# EAGLE design piezo-preamp-tickler_V3-10_single-supply-OPA1642 (EAGLE 8.5.0)

## Sheet 1 of 2
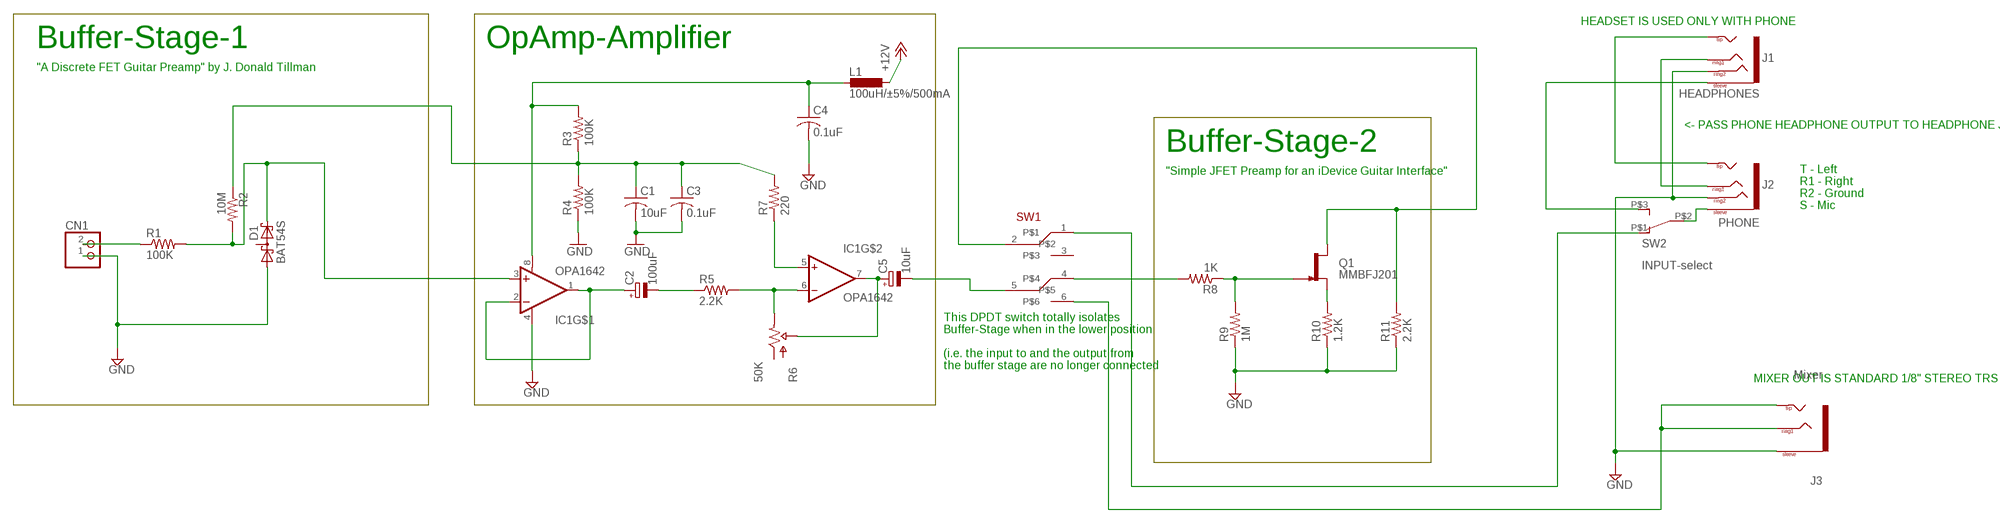
[diagram p0: schematic, sheet 1]

### Parts
C1  10uF  C-USC0805K  [C0805K]
C2  100uF  CPOL-EUC  [PANASONIC_C]
C3  0.1uF  C-USC0805K  [C0805K]
C4  0.1uF  C-USC0805K  [C0805K]
C5  10uF  CPOL-EUB  [PANASONIC_B]
CN1  JST_2PIN-THM  [JST-PH-2-THM]
D1  BAT54S  [SOT23]
IC1  OPA1642  [SO08]
J1  HEADPHONES  TRRS-1/8"-3.5MMLGPADS  [TRRS_SJ-43514-SMT-TR]
J2  PHONE  TRRS-1/8"-3.5MMLGPADS  [TRRS_SJ-43514-SMT-TR]
J3  Mixer  TRS-1/8"-3.5MM  [TRS_SJ-3524-SMT]
L1  100uH/±5%/500mA  L-EUL3225M  [L3225M]
Q1  MMBFJ201  J201SOT-23  [SOT23-3]
R1  100K  R-US_R0603  [R0603]
R2  10M  R-US_R0603  [R0603]
R3  100K  R-US_R0603  [R0603]
R4  100K  R-US_R0603  [R0603]
R5  2.2K  R-US_R0603  [R0603]
R6  50K  POTTHUMBPOT14  [THUMBPOT14MM]
R7  220  R-US_R0603  [R0603]
R8  1K  R-US_R0603  [R0603]
R9  1M  R-US_R0603  [R0603]
R10  1.2K  R-US_R0603  [R0603]
R11  2.2K  R-US_R0603  [R0603]
SW1  SWITCH_DPDT  [SWITCH_DPDT_CL-SB-22B]
SW2  INPUT-select  SWITCH_SPDTCL-SB-12B  [SWITCH_SPDT_CL-SB-12B]

### Nets
+12V: L1.1 ; also sheet 2
GND: C1.2 C3.2 C4.2 CN1.1 D1.1(A1) IC1.4(V-) J1.RING2 J2.RING2 J3.1(SLEEVE) R4.1 R9.1 R10.1 R11.1 ; also sheet 2
N$1: D1.2(C2) IC1.3(+IN) R1.2 R2.2
N$2: CN1.2 R1.1
N$3: Q1.2(S) R10.2
N$4: J1.EARTH(SLEEVE) SW2.P$3
N$5: IC1.5(+IN) R7.1
N$6: C5.+ IC1.7(OUT) R6.P$2(WIPER)
N$7: IC1.6(-IN) R5.2 R6.P$3(OUT)
N$8: C4.1 IC1.8(V+) L1.2 R3.2
N$9: C1.1 C3.1 R2.1 R3.1 R4.2 R7.2
N$10: Q1.3(G) R8.1 R9.2
N$11: R8.2 SW1.4
N$12: J3.2(TIP) J3.3(RING1) J3.4(TIP) SW1.6
N$13: J1.RING1 J2.RING1
N$14: C2.- R5.1
N$16: C5.- SW1.5
N$17: J2.EARTH(SLEEVE) SW2.P$2
N$19: SW1.1 SW2.P$1
N$24: C2.+ IC1.1(OUT) IC1.2(-IN)
N$33: J1.TIP J2.TIP
SELECT: Q1.1(D) R11.2 SW1.2
Unconnected: D1.3(C1A2) R6.P$1(IN) SW1.3

### Notes on the sheet
- HEADSET IS USED ONLY WITH PHONE
- Buffer-Stage-1 | OpAmp-Amplifier
- "A Discrete FET Guitar Preamp" by J. Donald Tillman
- <- PASS PHONE HEADPHONE OUTPUT TO HEADPHONE JACK
- Buffer-Stage-2
- "Simple JFET Preamp for an iDevice Guitar Interface"
- T - Left
  R1 - Right
  R2 - Ground
  S - Mic
- This DPDT switch totally isolates 
  Buffer-Stage when in the lower position
  
  (i.e. the input to and the output from 
  the buffer stage are no longer connected
- MIXER OUT IS STANDARD 1/8" STEREO TRS

## Sheet 2 of 2
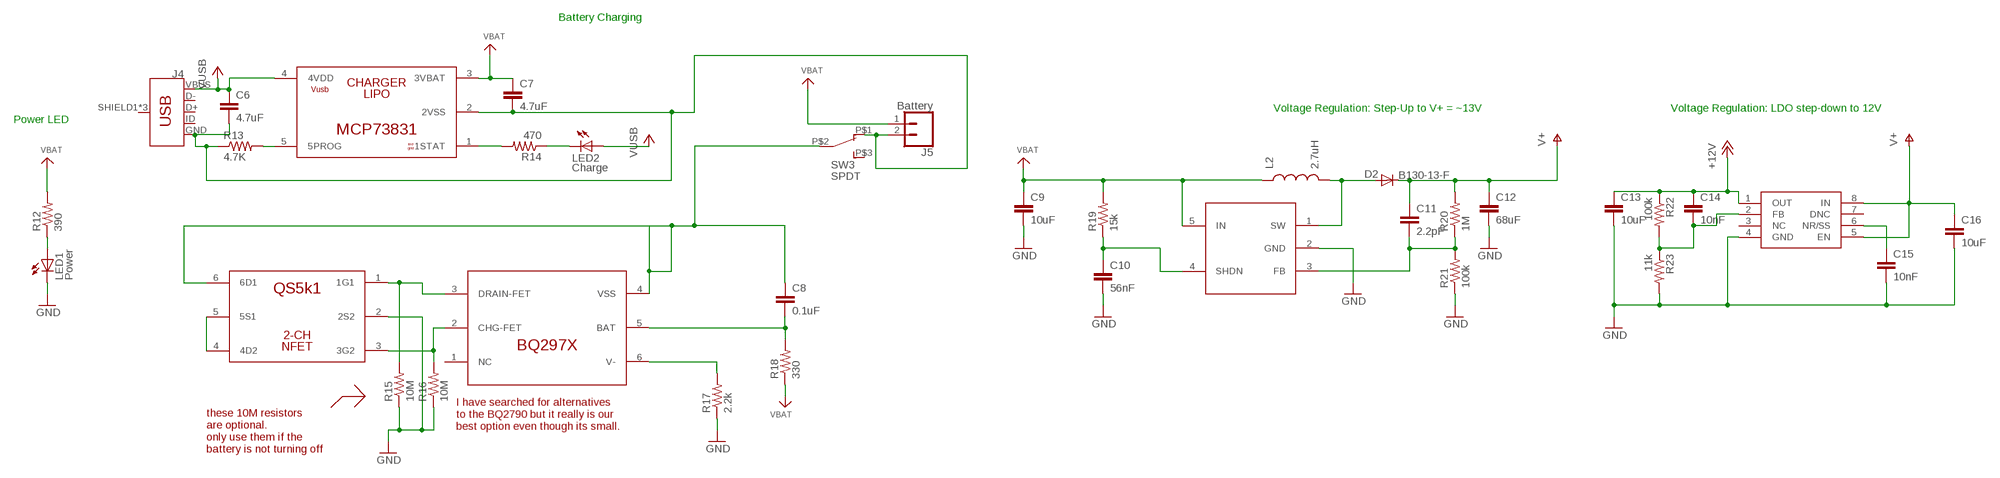
[diagram p1: schematic, sheet 2]

### Parts
C6  4.7uF  C-EUC0603  [C0603]
C7  4.7uF  C-EUC0603  [C0603]
C8  0.1uF  C-EUC0603  [C0603]
C9  10uF  C-EUC0603  [C0603]
C10  56nF  C-EUC0603  [C0603]
C11  2.2pF  C-EUC0603  [C0603]
C12  68uF  C-EUC1206  [C1206]
C13  10uF  C-EUC0603  [C0603]
C14  10nF  C-EUC0603  [C0603]
C15  10nF  C-EUC0603  [C0603]
C16  10uF  C-EUC0603  [C0603]
D2  B130-13-F  DIODESMA  [SMA-DIODE]
IC2  MCP73831  [SOT-23-5]
IC3  QS6K1  [SOT457R_PHILIPS]
IC4  BQ297X  BQ297X-BATTERY-MANAGERLONG  [WSON-6-LONG]
IC5  SC4503  [SOT23-5]
IC6  TPS7A49  [MSOP-8]
J4  USB_MICRO-BREDUCED_PASTE  [USB-B-MICRO-SMD_RED_PASTE]
J5  Battery  CONN_02LOCK  [1X02_LOCK]
L2  2.7uH  INDUCTORCR54  [CR54]
LED1  Power  LED3MM  [LED3MM]
LED2  Charge  LED3MM  [LED3MM]
R12  390  R-US_R0603  [R0603]
R13  4.7K  R-US_R0603  [R0603]
R14  470  R-US_R0603  [R0603]
R15  10M  R-US_R0603  [R0603]
R16  10M  R-US_R0603  [R0603]
R17  2.2k  R-US_R0603  [R0603]
R18  330  R-US_R0603  [R0603]
R19  15k  R-US_R0603  [R0603]
R20  1M  R-US_R0603  [R0603]
R21  100k  R-US_R0603  [R0603]
R22  100k  R-US_R0603  [R0603]
R23  11k  R-US_R0603  [R0603]
SW3  SPDT  SWITCH_SPDTCL-SB-12B  [SWITCH_SPDT_CL-SB-12B]

### Nets
+5V: C6.1 IC2.4(4VDD) J4.VBUS LED2.A ; supply symbol labelled VUSB
+12V: C13.1 C14.1 IC6.1(OUT) R22.1 ; also sheet 1
BATGND: C8.1 IC3.6(6D1) IC4.4(VSS) SW3.P$2
GND: C9.2 C10.2 C12.2 C13.2 C15.2 C16.2 IC3.2(2S2) IC5.2(GND) IC6.4(GND) LED1.K(C) R15.1 R16.1 R17.1 R21.1 R23.2 ; also sheet 1
N$18: LED1.A R12.1
N$21: IC2.5(5PROG) R13.2
N$22: LED2.K(C) R14.1
N$23: IC3.4(4D2) IC3.5(5S1)
N$25: IC2.1(1STAT) R14.2
N$26: C14.2 IC6.2(FB) R22.2 R23.1
N$27: IC3.1(1G1) IC4.3(DRAIN-FET) R15.2
N$28: C15.1 IC6.6(NR/SS)
N$29: C10.1 IC5.4(SHDN) R19.1
N$30: C11.2 IC5.3(FB) R20.1 R21.2
N$31: IC3.3(3G2) IC4.2(CHG-FET) R16.2
N$32: D2.A IC5.1(SW) L2.P$2
N$34: IC4.6(V-) R17.2
N$42: C8.2 IC4.5(BAT) R18.2
USBGND: C6.2 C7.2 IC2.2(2VSS) J4.GND J5.2 R13.1 SW3.P$1
V+: C11.1 C12.1 C16.1 D2.C IC6.5(EN) IC6.8(IN) R20.2
VBAT: C7.1 C9.1 IC2.3(3VBAT) IC5.5(IN) J5.1 L2.P$1 R12.2 R18.1 R19.2
Unconnected: IC4.1(NC) IC6.3(NC) IC6.7(DNC) J4.D+ J4.D- J4.ID J4.SHIELD1(SHIELD) J4.SHIELD2(SHIELD) J4.SHIELD3(SHIELD) SW3.P$3

### Notes on the sheet
- Battery Charging
- Voltage Regulation: Step-Up to V+ = ~13V | Voltage Regulation: LDO step-down to 12V
- Power LED
- I have searched for alternatives 
  to the BQ2790 but it really is our 
  best option even though its small.
- these 10M resistors
  are optional. 
  only use them if the 
  battery is not turning off

## Library data of the parts
C1 C3 C4 = adafruit:C-US: CAPACITOR, American symbol
C2 C5 = resistor:CPOL-EU: POLARIZED CAPACITOR, European symbol
C6-C16 = rcl:C-EU: CAPACITOR, European symbol; SPICEPREFIX: C
CN1 = adafruit:JST_2PIN: JST 2-Pin Connectors of various flavors SMT-RA (S2B-PH-SM4) 4UConnector #17311 SMT (B2B-PH-SM4) THM-RA (S2B-PH) THM (B2B-PH)
D1 = diode:BAT54S: Schottky Diodes Pin connection corrected 2011-05-04 Source: Fairchild .. BAT54.pdf
D2 = SparkFun:DIODE: Diode These are standard reverse protection diodes and small signal diodes. SMA package can handle up to about 1A. SOD-323 can handle about 200mA. What the SOD-323 package when ordering, there are some mfgs out there that are 5-pin packages.
IC1 = CMU-ArtFab:OPA1642
IC2 = CMU-ArtFab:MCP73831
IC3 = CMU-ArtFab:QS6K1
IC4 = CMU-ArtFab:BQ297X-BATTERY-MANAGER
IC5 = CMU-ArtFab:SC4503
IC6 = CMU-ArtFab:TPS7A49
J1 J2 = CMU-ArtFab:TRRS-1/8"-3.5MM: Audio jack - 3.5mm TRRS variety - two rings.
J3 = CMU-ArtFab:TRS-1/8"-3.5MM
J4 = CMU-ArtFab:USB_MICRO-B: USB Type Micro-B Connector Male/female and PTH/SMT variants SparkFun Products: SparkFun microB USB Breakout <https://www.sparkfun.com/products/12035> SparkFun USB microB Plug Breakout <https://www.sparkfun.com/products/10031> SparkFun ESP8266 Thing <https://www.sparkfun.com/products/13231>; PROD_ID: CONN-11752
J5 = SparkFun-Connectors:CONN_02: Multi connection point. Often used as Generic Header-pin footprint for 0.1 inch spaced/style header connections On any of the 0.1 inch spaced packages, you can populate with these: Break Away Headers - Straight <https://www.sparkfun.com/products/116> (PRT-00116) Break Away Male Headers - Right Angle <https://www.sparkfun.com/products/553> (PRT-00553) Female Headers <https://www.sparkfun.com/products/115> (PRT-00115) Break Away Headers - Machine Pin <https://www.sparkfun.com/products/117> (PRT-00117) Break Away Female Headers - Swiss Machine Pin <https://www.sparkfun.com/products/743> (PRT-00743) For SCREWTERMINALS and SPRING TERMINALS visit here: Screw Terimnals on SparkFun.com <https://www.sparkfun.com/search/results?term=Screw+Terminals> (5mm/3.5mm/2.54mm spacing) This device is also useful as a general connection point to wire up your design to another part of your project. Our various solder wires solder well into these plated through hole pads. Hook-Up Wire - Assortment (Stranded, 22 AWG) <https://www.sparkfun.com/products/11375> (PRT-11375) Hook-Up Wire - Assortment (Solid Core, 22 AWG) <https://www.sparkfun.com/products/11367> (PRT-11367) View the entire wire category on our website here <https://www.sparkfun.com/categories/141> Special notes: Molex polarized connector foot print use with: PRT-08233 with associated crimp pins and housings. 2.54_SCREWTERM for use with PRT-10571. 3.5mm Screw Terminal footprints for PRT-08084 5mm Screw Terminal footprints for use with PRT-08432
L1 = rcl:L-EU: INDUCTOR, European symbol; SPICEPREFIX: L
L2 = SparkFun-Passives:INDUCTOR: Inductors Basic Inductor/Choke - 0603 and 1206. Footprints are not proven and vary greatly between part numbers. SRN6045- 33uH, 20% 1.4A SDR0403-560KL - 56uH, 10%, 500mA RMS/740mA peak
LED1 LED2 = led:LED: LED OSRAM: - CHIPLED LG R971, LG N971, LY N971, LG Q971, LY Q971, LO R971, LY R971 LH N974, LH R974 LS Q976, LO Q976, LY Q976 LO Q996 - Hyper CHIPLED LW Q18S LB Q993, LB Q99A, LB R99A - SideLED LS A670, LO A670, LY A670, LG A670, LP A670 LB A673, LV A673, LT A673, LW A673 LH A674 LY A675 LS A676, LA A676, LO A676, LY A676, LW A676 LS A679, LY A679, LG A679 - Hyper Micro SIDELED® LS Y876, LA Y876, LO Y876, LY Y876 LT Y87S - SmartLED LW L88C, LW L88S LB L89C, LB L89S, LG L890 LS L89K, LO L89K, LY L89K LS L896, LA L896, LO L896, LY L896 - TOPLED LS T670, LO T670, LY T670, LG T670, LP T670 LSG T670, LSP T670, LSY T670, LOP T670, LYG T670 LG T671, LOG T671, LSG T671 LB T673, LV T673, LT T673, LW T673 LH T674 LS T676, LA T676, LO T676, LY T676, LB T676, LH T676, LSB T676, LW T676 LB T67C, LV T67C, LT T67C, LS T67K, LO T67K, LY T67K, LW E67C LS E67B, LA E67B, LO E67B, LY E67B, LB E67C, LV E67C, LT E67C LW T67C LS T679, LY T679, LG T679 LS T770, LO T770, LY T770, LG T770, LP T770 LB T773, LV T773, LT T773, LW T773 LH T774 LS E675, LA E675, LY E675, LS T675 LS T776, LA T776, LO T776, LY T776, LB T776 LHGB T686 LT T68C, LB T68C - Hyper Mini TOPLED® LB M676 - Mini TOPLED Santana® LG M470 LS M47K, LO M47K, LY M47K Source: http://www.osram.convergy.de LUXEON: - LUMILED® LXK2-PW12-R00, LXK2-PW12-S00, LXK2-PW14-U00, LXK2-PW14-V00 LXK2-PM12-R00, LXK2-PM12-S00, LXK2-PM14-U00 LXK2-PE12-Q00, LXK2-PE12-R00, LXK2-PE12-S00, LXK2-PE14-T00, LXK2-PE14-U00 LXK2-PB12-K00, LXK2-PB12-L00, LXK2-PB12-M00, LXK2-PB14-N00, LXK2-PB14-P00, LXK2-PB14-Q00 LXK2-PR12-L00, LXK2-PR12-M00, LXK2-PR14-Q00, LXK2-PR14-R00 LXK2-PD12-Q00, LXK2-PD12-R00, LXK2-PD12-S00 LXK2-PH12-R00, LXK2-PH12-S00 LXK2-PL12-P00, LXK2-PL12-Q00, LXK2-PL12-R00 Source: www.luxeon.com KINGBRIGHT: KA-3528ASYC Source: www.kingbright.com
Q1 = CMU-ArtFab:J201: N-channel JFET
R1-R5 R7-R23 = CMU-ArtFab:R-US_: RESISTOR, American symbol
R6 = CMU-ArtFab:POT: http://www.taydaelectronics.com/10k-ohm-linear-taper-potentiometer-round-shaft-pcb-9mm.html http://www.taydaelectronics.com/datasheets/A-1847.pdf
SW1 = CMU-ArtFab:SWITCH_DPDT
SW2 SW3 = CMU-ArtFab:SWITCH_SPDT

## Board
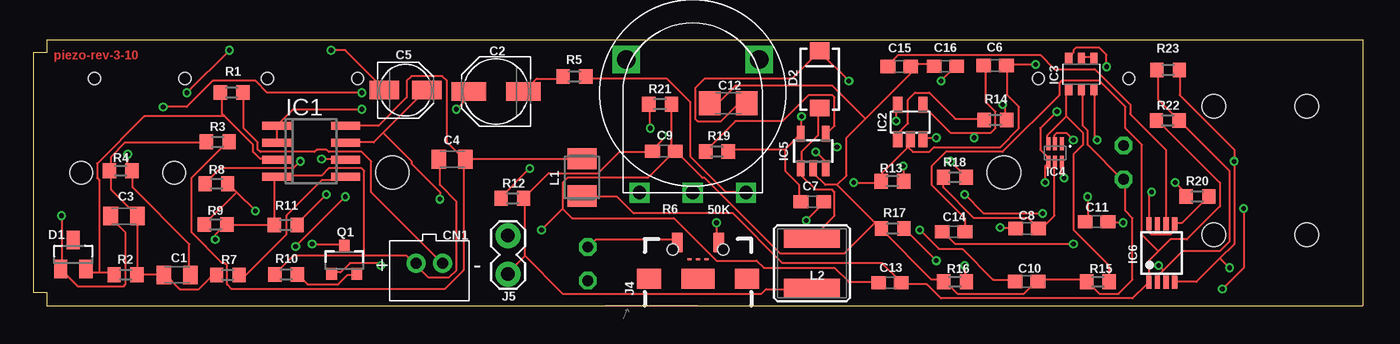
[diagram p2: board, top side]
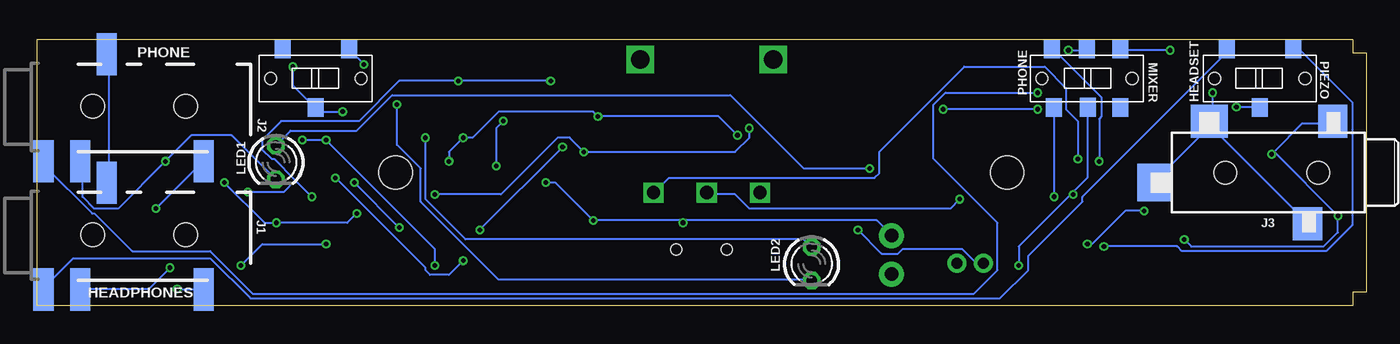
[diagram p3: board, bottom side, seen from below]

Size 100 x 20 mm. Coordinates in mm from the lower left corner, seen from the top.
Outline: 0,19 0,1 1.02,1 1,0 100,0 100,20 1,20 1,19 0,19
Copper layers (1*16): Top 0.035mm / dielectric 1.5mm / Bottom 0.035mm
Design rules "SeeedStudio_2layer_DRU_no_angle_20140221": minimum track width 6mil, minimum drill 12mil, track to track 6mil, track to pad 6mil, pad to pad 6mil, via to via 6mil, smd to smd 0mil, copper to edge 10mil, drill to drill 10mil, minimum pad ring 10mil, minimum via ring 6mil, stop-mask expansion 2mil, vias tented up to drill 100mil, thermal gap 10mil
Holes 2.5 mm at 73,10 27,10

### Footprints (pad centres in the part's own frame; a part is rotated, then mirrored left to right if it is on the bottom)
C0805K = smd 1.1 x 1.4: 1 -1,0; 2 1,0
PANASONIC_C = smd 2.6 x 1.4: + 2.05,0; - -2.05,0
PANASONIC_B = smd 2.2 x 1.4: + 1.6,0; - -1.6,0
C0603 = smd 1.1 x 1: 1 -0.85,0; 2 0.85,0
C1206 = smd 1.6 x 1.8: 1 -1.4,0; 2 1.4,0
JST-PH-2-THM = drill 0.8 pad 1.422: 1 1,0; 2 -1,0
SOT23 = smd 1 x 1.4: 1 -0.95,-1.1; 2 0.95,-1.1; 3 0,1.1
SMA-DIODE = smd 1.27 x 1.47: A -2.15,0; C 2.15,0
SO08 = smd 0.6 x 2.2: 1 -1.905,-2.6; 2 -0.635,-2.6; 3 0.635,-2.6; 4 1.905,-2.6; 5 1.905,2.6; 6 0.635,2.6; 7 -0.635,2.6; 8 -1.905,2.6
SOT-23-5 = smd 0.69 x 1.2: 1 -0.95,-1.3; 2 0,-1.3; 3 0.95,-1.3; 4 0.95,1.3; 5 -0.95,1.3
SOT457R_PHILIPS = smd 0.55 x 0.8: 1 -0.95,-1.2; 2 0,-1.2; 3 0.95,-1.2; 4 0.95,1.2; 5 0,1.2; 6 -0.95,1.2
WSON-6-LONG = smd 0.3 x 0.954: 1 -0.5,-0.686; 2 0,-0.686; 3 0.5,-0.686; 4 0.5,0.686; 5 0,0.686; 6 -0.5,0.686
SOT23-5 = smd 0.55 x 1.2: 1 -0.95,-1.3; 2 0,-1.3; 3 0.95,-1.3; 4 0.95,1.3; 5 -0.95,1.3
MSOP-8 = smd 0.4 x 1: 1 -0.975,-2.2; 2 -0.325,-2.2; 3 0.325,-2.2; 4 0.975,-2.2; 5 0.975,2.2; 6 0.325,2.2; 7 -0.325,2.2; 8 -0.975,2.2
TRRS_SJ-43514-SMT-TR = smd 1.524 x 3.175: EARTH -7.067,-4.128; RING1 -2.309,3.901; RING2 -4.293,-4.128; TIP 4.995,-4.128 | hole 1.778: -3.353,-0.007; 3.647,-0.007
TRS_SJ-3524-SMT = smd 2.5 x 2.2: 1 3.85,-4.6; 3 -3.85,-2.7 | smd 2.5 x 2.8: 2 3.85,4.7 | smd 2.8 x 2.5: 4 -0.75,8.85 | hole 1.7: 0,-3.5; 0,3.5
USB-B-MICRO-SMD_RED_PASTE = smd 0.152 x 0.305: D+ 1.455,0; D- 1.455,0.65; ID 1.455,-0.65 | smd 1.45 x 0.762: GND 2.725,-1.554 | smd 1.5 x 1.8: SHIELD1 0,3.685; SHIELD2 0,-3.685 | smd 1.5 x 2.5: SHIELD3 0,0 | smd 1.45 x 0.781: VBUS 2.725,1.554 | hole 0.85: 2.2,1.9; 2.2,-1.9
1X02_LOCK = drill 1.016 pad 1.88: 1 -0.178,0; 2 2.718,0
L3225M = smd 1.6 x 2.2: 1 -1.4,0; 2 1.4,0
CR54 = smd 4.2 x 1.4: P$1 0,1.85; P$2 0,-1.85
LED3MM = drill 0.813 octagon: A -1.27,0; K 1.27,0
SOT23-3 = smd 0.8 x 0.9: 1 -0.95,-1; 2 0.95,-1; 3 0,1.1
R0603 = smd 1 x 1.1: 1 -0.85,0; 2 0.85,0
THUMBPOT14MM = drill 1 square: P$1 -4,-7.5; P$2 0,-7.5; P$3 4,-7.5 | drill 1.4 square: P$4 -5,2.5; P$5 5,2.5
SWITCH_DPDT_CL-SB-22B = smd 1.2 x 1.4: 1 -2.5,-2.2; 2 0.05,-2.17; 3 2.5,-2.2; 4 -2.63,2.2; 5 0,2.2; 6 2.51,2.2 | hole 0.9: -3.4,0; 3.4,0
SWITCH_SPDT_CL-SB-12B = smd 1.2 x 1.4: P$1 -2.5,-2.2; P$2 0,2.2; P$3 2.5,-2.2 | hole 0.9: -3.4,0; 3.4,0

### Placement (x,y rotation side)
C1  10.82,2.31 0 top
C2  34.8,16.1 180 top
C3  6.83,6.73 180 top
C4  31.51,11 180 top
C5  28,16.2 0 top
C6  72.34,18.04 0 top
C7  58.59,7.8 0 top
C8  74.75,5.79 0 top
C9  47.43,11.61 0 top
C10  74.71,1.81 0 top
C11  79.97,6.31 0 top
C12  52.27,15.2 180 top
C13  64.43,1.72 180 top
C14  69.22,5.56 180 top
C15  65.13,17.98 0 top
C16  68.6,18 180 top
CN1  29.79,3.18 180 top
D1  3.01,3.84 0 top
D2  59.14,17 90 top
IC1  20.9,11.6 270 top
IC2  65.96,13.79 0 top
IC3  78.82,17.4 0 top
IC4  76.84,11.48 180 top
IC5  58.66,11.62 0 top
IC6  84.87,3.95 0 top
J1  92.43,5.33 0 bottom
J2  92.43,14.99 0 bottom
J3  7.11,10 90 bottom
J4  50,2.02 90 top
J5  35.71,2.54 90 top
L1  41.27,9.64 90 top
L2  58.57,3.19 180 top
LED1  82,10.76 270 bottom
LED2  41.71,3.14 270 bottom
Q1  23.39,3.4 0 top
R1  14.93,16.01 180 top
R2  6.94,2.32 180 top
R3  13.88,12.31 0 top
R4  6.58,10.14 180 top
R5  40.7,17.23 0 top
R6  49.6,16 0 top
R7  14.64,2.31 180 top
R8  13.78,9.16 180 top
R9  13.72,6.1 180 top
R10  19.02,2.34 0 top
R11  18.99,6.07 0 top
R12  36.03,8.07 0 top
R13  64.61,9.35 0 top
R14  72.36,13.96 180 top
R15  80.06,1.79 0 top
R16  69.33,1.79 0 top
R17  64.64,5.79 0 top
R18  69.3,9.65 180 top
R19  51.43,11.58 0 top
R20  87.56,8.2 0 top
R21  47.15,15.14 180 top
R22  85.32,13.92 0 top
R23  85.35,17.72 0 top
SW1  21,17.08 0 bottom
SW2  8,17.08 180 bottom
SW3  79,17.08 180 bottom

### Tracks (layer width: path | path; a pad name or v marks a point on that pad's centre or on a via)
+5V  (via drill 0.35)
  Top 0.152: 70.76,12.98 68.99,12.98 67.03,14.94 IC2.4 | 70.76,12.98 72.01,12.98 72.36,13.34 72.36,14.58 71.65,15.29 71.65,17.96 C6.1 | J4.VBUS 48.54,4.8 48.36,4.98 42.32,4.98 41.78,4.45 LED2.A | v70.76,12.62 70.76,12.98
  Bottom 0.152: v70.76,12.62 70.76,8 67.74,4.98 42.32,4.98 41.78,4.45 LED2.A
+12V
  Top 0.152: 84.63,4.09 85.52,4.98 86.77,4.98 89.26,7.47 89.26,9.25 84.63,13.87 R22.1 | 84.63,4.09 83.92,3.38 83.92,1.78 IC6.1 83.74,1.6 82.68,0.53 68.28,0.53 67.21,1.6 65.43,1.6 C13.1 65.25,1.78 63.83,3.2 56.36,3.2 52.63,6.93 45.16,6.93 43.92,8.18 41.43,8.18 L1.1 | 84.63,4.09 83.39,5.33 83.39,12.09 82.14,13.34 82.14,14.94 80.19,16.89 77.34,16.89 77.17,16.71 77.17,15.82 72.9,11.56 68.63,11.56 67.56,10.49 67.56,9.07 70.05,6.58 70.05,5.69 C14.1
BATGND  (via drill 0.35)
  Top 0.152: v80.72,17.96 80.72,18.85 80.19,19.38 78.41,19.38 78.23,19.2 78.23,19.02 77.88,18.67 IC3.6 | v76.99,14.58 75.74,13.34 75.74,11.73 76.28,11.2 76.28,10.85 IC4.4 76.28,10.67 76.1,10.49 v76.1,9.25 | v72.72,5.87 73.79,5.87 C8.1
  Bottom 0.152: v80.72,17.96 80.72,16.54 79.12,14.94 SW3.P$2 78.94,14.76 78.77,14.58 v76.99,14.58 | v76.1,9.25 v72.72,5.87
GND  (via drill 0.35)
  Top 0.152: C3.2 5.87,6.58 6.93,5.51 6.93,1.6 6.76,1.42 3.38,1.42 2.13,2.67 D1.1 2.13,2.85 v2.13,6.76 | C1.2 11.73,2.49 11.73,4.62 7.47,8.89 7.47,10.13 R4.1 7.29,10.31 7.11,10.49 v7.11,11.38 | 24.89,3.73 28.09,3.73 28.63,3.2 CN1.1 28.8,3.02 29.69,2.13 31.29,2.13 31.83,2.67 31.83,7.82 30.58,9.07 30.58,10.85 C4.2 | 24.89,3.73 19.56,3.73 18.31,2.49 R10.1 | 24.89,3.73 24.89,10.13 24.71,10.31 22.23,10.31 21.69,9.78 18.31,9.78 IC1.4 18.14,9.6 18.14,6.22 R11.1 18.14,6.04 14.58,6.04 R9.1 14.4,6.04 13.69,5.33 v13.69,4.98 | 39.83,7.29 40.54,6.58 48.18,6.58 51.38,3.38 54.41,3.38 54.94,2.85 60.27,2.85 61.34,1.78 63.48,1.78 C13.2 | 39.83,7.29 39.83,9.25 40.18,9.6 46.23,9.6 48.18,11.56 C9.2 | R21.1 48.01,15.11 48.01,11.91 48.18,11.73 C9.2 | 89.26,3.56 90.32,4.62 v90.32,10.85 90.32,11.73 86.23,15.82 86.23,17.6 R23.2 | 89.26,3.56 87.48,1.78 85.88,1.78 IC6.4 | 89.26,3.56 v89.97,2.85 | IC3.2 78.94,16.18 78.94,13.51 79.3,13.16 79.3,12.09 81.97,9.42 LED1.K 82.14,9.42 82.14,7.11 82.68,6.58 82.68,1.96 81.61,0.89 80.19,0.89 79.3,1.78 R15.1 79.12,1.96 75.56,1.96 C10.2 75.39,1.78 74.5,0.89 69.52,0.89 68.63,1.78 R16.1 68.45,1.96 67.56,1.96 63.83,5.69 R17.1 | C16.2 67.74,18.14 66.14,18.14 C15.2 65.96,17.96 65.96,17.42 62.59,14.05 | 60.45,9.07 59.56,9.07 58.67,9.96 58.67,10.31 IC5.2 | 63.3,6.22 63.65,5.87 R17.1 | 63.3,6.22 60.45,9.07 | 62.59,14.05 61.16,12.62 61.16,9.78 60.45,9.07 | 62.59,14.05 60.1,16.54 52.81,16.54 51.56,15.29 51.03,15.29 C12.2 | 63.3,6.22 60.98,3.91 56.19,3.91 50.49,9.6 50.32,9.6 48.36,11.56 C9.2 | 63.3,6.22 R17.1 | 39.83,7.29 v38.23,5.69
  Bottom 0.152: 6.93,11.56 4.8,13.69 2.67,13.69 J3.1 | 6.93,11.56 v2.13,6.76 2.13,5.51 3.2,4.45 13.16,4.45 v13.69,4.98 | 6.93,11.56 v7.11,11.38 | v89.97,2.85 91.57,1.25 96.55,1.25 J1.RING2 | J2.RING2 96.55,10.85 96.55,8.18 95.66,7.29 93.88,7.29 v90.32,10.85 88.37,12.8 85.34,12.8 82.14,9.6 LED1.K | v38.23,5.69 36.45,3.91 35.2,3.91 34.85,4.27 30.4,4.27 29.34,3.2 28.8,3.2 CN1.1
N$1
  Top 0.152: 4.98,2.49 4.27,2.49 4.09,2.67 D1.2 | 4.98,2.49 6.04,2.49 R2.2 | 14.4,14.22 16.54,12.09 16.54,11.56 17.07,11.02 18.14,11.02 IC1.3 | 14.4,14.22 14.22,14.4 14.22,16 R1.2 | 4.98,2.49 4.98,9.42 4.8,9.6 4.8,10.67 8.36,14.22 14.4,14.22
N$2
  Top 0.152: R1.1 15.82,16 15.82,13.34 16.89,12.27 16.89,11.73 17.07,11.56 21.16,11.56 21.34,11.73 22.05,11.73 22.23,11.56 24.71,11.56 25.43,10.85 25.43,8.53 30.76,3.2 CN1.2
N$3
  Top 0.152: Q1.2 24.18,2.31 23.65,2.31 22.94,1.6 20.62,1.6 19.91,2.31 R10.2
N$4
  Bottom 0.152: SW2.P$3 10.67,19.2 10.67,18.85 21.34,8.18 21.34,7.82 25.43,3.73 25.43,2.67 27.56,0.53 83.92,0.53 86.94,3.56 97.26,3.56 99.57,1.25 J1.EARTH
N$5
  Top 0.152: R7.1 15.65,2.31 16,2.31 19.02,5.33 19.02,6.76 21.69,9.42 23.29,9.42 23.47,9.6 IC1.5
N$6  (via drill 0.35)
  Top 0.152: 26.31,12.98 29.52,16.18 C5.+ | 26.31,12.98 25.6,12.27 23.65,12.27 IC1.7 | v30.58,8 30.58,8.53 28.45,10.67 28.45,10.85 26.31,12.98
  Bottom 0.152: v30.58,8 31.29,7.29 46.41,7.29 47.47,8.36 49.43,8.36 R6.P$2
N$7  (via drill 0.35)
  Top 0.152: R5.2 41.6,17.07 47.65,17.07 49.43,15.29 49.43,11.2 52.09,8.53 53.52,8.53 R6.P$3 | v21.69,11.02 23.47,11.02 IC1.6
  Bottom 0.152: v21.69,11.02 21.69,13.87 22.58,14.76 22.58,16.36 24.18,17.96 30.23,17.96 36.63,11.56 36.63,9.96 36.98,9.6 52.45,9.6 53.52,8.53 R6.P$3
N$8
  Top 0.152: R3.2 14.58,12.27 11.91,9.6 11.91,5.51 14.22,3.2 14.4,3.2 14.58,3.02 14.58,1.6 14.94,1.25 30.94,1.25 32.36,2.67 32.36,10.85 C4.1 | IC1.8 23.65,13.51 25.96,13.51 28.09,15.65 28.09,16.89 28.45,17.25 30.76,17.25 31.11,16.89 31.11,12.27 32.36,11.02 C4.1 | L1.2 41.25,11.02 32.54,11.02 C4.1
N$9
  Top 0.152: R7.2 13.69,2.13 13.34,2.13 12.45,1.25 11.02,1.25 9.96,2.31 C1.1 9.78,2.31 7.82,2.31 R2.1 7.82,2.49 7.82,6.58 C3.1 7.82,6.76 5.87,8.71 5.87,10.13 R4.2 5.87,10.31 5.87,11.2 6.93,12.27 12.98,12.27 R3.1
N$10  (via drill 0.35)
  Top 0.152: v20.98,4.62 23.29,4.62 Q1.3 | 15.29,8.53 14.76,9.07 R8.1 | 15.29,8.53 v16.71,7.11 | 15.29,8.53 12.98,6.22 R9.2
  Bottom 0.152: v20.98,4.62 20.62,4.62 18.14,7.11 v16.71,7.11
N$11  (via drill 0.35)
  Top 0.152: v20.09,10.85 19.56,10.31 14.05,10.31 12.98,9.25 R8.2
  Bottom 0.152: v20.09,10.85 20.09,14.05 19.91,14.22 19.91,15.65 23.47,19.2 SW1.4
N$12  (via drill 0.35)
  Top 0.152: v11.56,16 v14.76,19.2
  Bottom 0.152: v14.76,19.2 18.31,19.2 SW1.6 | v11.56,16 11.56,14.05 11.73,13.87 J3.2 | 11.73,13.51 11.91,13.69 J3.2 | 11.73,13.51 4.45,6.22 J3.3 | 11.73,13.51 15.82,9.42 J3.4 | 11.73,13.51 J3.2
N$13
  Bottom 0.152: J1.RING1 94.59,9.25 94.59,18.85 J2.RING1
N$14
  Top 0.152: R5.1 39.83,17.07 37.87,17.07 36.98,16.18 C2.-
N$16  (via drill 0.35)
  Top 0.152: v22.4,19.2 23.47,19.2 26.31,16.36 C5.-
  Bottom 0.152: v22.4,19.2 21.16,19.2 SW1.5
N$17  (via drill 0.35)
  Top 0.152: v9.78,14.94 11.56,14.94 13.51,16.89 16.71,16.89 17.6,16 v24.71,16
  Bottom 0.152: v9.78,14.94 8,14.94 SW2.P$2 | v24.71,16 31.65,16 32.54,15.11 32.54,11.02 27.74,6.22 27.74,2.67 29.52,0.89 83.74,0.89 86.94,4.09 92.81,4.09 95.66,6.93 95.83,6.93 99.39,10.49 99.39,10.85 J2.EARTH
N$18  (via drill 0.35)
  Top 0.152: v37.34,10.31 35.2,8.18 R12.1
  Bottom 0.152: v37.34,10.31 42.32,10.31 47.83,15.82 73.25,15.82 75.92,13.16 80.9,13.16 81.97,12.09 LED1.A
N$19  (via drill 0.35)
  Top 0.152: v19.74,4.45 v23.47,8.18
  Bottom 0.152: v23.47,8.18 23.47,14.76 SW1.1 | v19.74,4.45 14.22,4.45 13.87,4.09 3.02,4.09 1.07,6.04 1.07,15.29 4.98,19.2 5.33,19.2 SW2.P$1
N$21  (via drill 0.35)
  Top 0.152: v65.43,10.49 65.43,9.42 R13.2 | v64.9,13.87 64.9,14.94 IC2.5
  Bottom 0.152: v65.43,10.49 65.43,13.34 v64.9,13.87
N$22  (via drill 0.35)
  Top 0.152: v72.9,15.11 73.08,14.94 73.08,14.05 R14.1
  Bottom 0.152: v72.9,15.11 72.9,12.09 71.12,10.31 71.12,7.82 65.25,1.96 41.78,1.96 LED2.K
N$23
  Top 0.152: IC3.5 78.94,18.67 79.65,18.67 IC3.4
N$24  (via drill 0.35)
  Top 0.152: IC1.2 18.31,12.27 18.31,13.34 IC1.1 18.31,13.51 19.56,14.76 v24.71,14.76 | v31.83,14.76 32.72,15.65 32.72,16 C2.+
  Bottom 0.152: v24.71,14.76 v31.83,14.76
N$25
  Top 0.152: R14.2 71.48,14.05 69.34,14.05 67.39,16 66.32,16 65.79,15.47 65.79,13.69 65.08,12.98 65.08,12.62 IC2.1
N$26  (via drill 0.35)
  Top 0.152: 84.99,2.67 86.41,4.09 89.26,4.09 89.97,4.8 89.97,10.13 86.23,13.87 R22.2 86.06,14.05 84.63,15.47 84.63,17.6 R23.1 | 84.99,2.67 84.63,2.31 84.63,1.78 IC6.2 | v78.23,4.62 69.34,4.62 68.45,5.51 C14.2 | 84.99,2.67 v84.63,3.02
  Bottom 0.152: v78.23,4.62 83.03,4.62 v84.63,3.02
N$27
  Top 0.152: 77.7,14.22 77.7,16.18 IC3.1 | 77.7,14.22 76.28,12.8 76.28,12.27 IC4.3 | 77.7,14.22 78.94,12.98 78.94,12.09 78.23,11.38 78.23,5.69 80.9,3.02 80.9,1.96 R15.2
N$28
  Top 0.152: IC6.6 85.17,6.22 85.17,11.73 82.5,14.4 82.5,15.11 79.83,17.78 76.81,17.78 75.74,18.85 65.08,18.85 64.36,18.14 C15.1
N$29  (via drill 0.35)
  Top 0.152: v66.67,5.69 68.1,4.27 69.88,4.27 72.19,1.96 73.79,1.96 C10.1 | v60.45,11.91 59.56,12.8 IC5.4 59.74,12.98 60.27,13.51 60.27,15.65 60.1,15.82 58.32,15.82 56.36,13.87 52.81,13.87 50.67,11.73 R19.1
  Bottom 0.152: v60.45,11.91 v66.67,5.69
N$30  (via drill 0.35)
  Top 0.152: v81.97,6.22 80.9,6.22 C11.2 | v85.88,9.25 86.77,8.36 R20.1 | v46.41,13.34 46.41,15.11 R21.2 | v58.85,11.56 59.56,10.85 59.56,10.49 IC5.3 | v75.92,6.93 71.48,6.93 v70.05,8.36
  Bottom 0.152: v85.88,9.25 82.86,6.22 v81.97,6.22 76.63,6.22 v75.92,6.93 | v46.41,13.34 46.41,12.62 47.47,11.56 v58.85,11.56 59.92,12.62 60.81,12.62 65.08,8.36 v70.05,8.36
N$31  (via drill 0.35)
  Top 0.152: v80.01,12.45 79.83,12.62 79.83,16.18 IC3.3 | v78.23,12.45 77.7,12.98 76.99,12.98 76.81,12.8 76.81,12.27 IC4.2 | v70.05,3.02 70.05,1.96 R16.2
  Bottom 0.152: v80.01,12.45 v78.23,12.45 70.05,4.27 v70.05,3.02
N$32
  Top 0.152: D2.A 59.03,14.76 59.03,12.8 57.78,11.56 57.78,10.49 IC5.1 57.78,10.31 57.78,9.78 58.85,8.71 60.1,8.71 60.27,8.53 60.27,6.76 58.67,5.16 L2.P$2
N$33  (via drill 0.35)
  Top 0.152: v89.43,1.25 91.03,2.85 v91.03,7.29
  Bottom 0.152: v89.43,1.25 87.48,1.25 J1.TIP | v91.03,7.29 87.48,10.85 J2.TIP
N$34  (via drill 0.35)
  Top 0.152: v77.52,9.6 77.34,9.78 77.34,10.67 IC4.6 | v67.92,3.38 65.61,5.69 R17.2
  Bottom 0.152: v77.52,9.6 70.76,2.85 70.76,2.67 70.41,2.31 68.99,2.31 v67.92,3.38
N$42
  Top 0.152: IC4.5 76.81,10.67 76.81,6.76 75.74,5.69 C8.2 75.56,5.87 74.85,6.58 70.76,6.58 68.45,8.89 R18.2
SELECT  (via drill 0.35)
  Top 0.152: v26.14,3.02 25.96,3.2 23.82,3.2 23.11,2.49 22.58,2.49 Q1.1 | v22.05,8.36 19.91,6.22 R11.2
  Bottom 0.152: v26.14,3.02 26.14,4.45 22.05,8.53 | 22.05,8.53 20.98,9.6 20.98,14.76 SW1.2 | 22.05,8.53 v22.05,8.36
USBGND  (via drill 0.35)
  Top 0.152: 65.79,11.91 63.83,9.96 63.83,9.42 R13.1 63.65,9.25 v61.7,9.25 | 65.79,11.91 65.79,12.45 IC2.2 65.79,11.91 | 65.79,11.91 66.14,11.56 67.39,11.56 67.74,11.91 72.72,11.91 74.14,13.34 74.14,14.94 73.25,15.82 73.25,17.96 C6.2 73.25,18.14 v75.39,18.14 | v58.14,6.4 59.38,7.64 C7.2 | v51.38,6.22 51.38,4.8 J4.GND
  Bottom 0.152: v75.39,18.14 76.45,19.2 SW3.P$1 | 51.38,6.4 36.8,6.4 35.74,5.33 J5.2 | 51.38,6.4 v58.14,6.4 60.98,9.25 v61.7,9.25 | 51.38,6.4 v51.38,6.22
V+  (via drill 0.35)
  Top 0.152: R20.2 88.37,8.18 86.41,6.22 85.88,6.22 IC6.5 85.7,6.04 85.7,5.51 85.52,5.33 84.1,5.33 83.92,5.51 83.92,6.04 IC6.8 83.92,6.22 83.92,8.36 v84.1,8.53 | v68.28,16.89 69.34,17.96 C16.1 | v61.34,16.89 59.21,19.02 D2.C 59.03,19.02 57.07,17.07 50.49,17.07 49.78,16.36 49.78,14.05 49.96,13.87 51.74,13.87 52.98,15.11 53.52,15.11 C12.1 | v79.3,8.18 79.3,6.4 C11.1
  Bottom 0.152: v61.34,16.89 v68.28,16.89 72.72,16.89 75.74,13.87 81.61,13.87 83.03,12.45 83.03,11.73 82.32,11.02 82.14,11.02 80.54,9.42 | 80.54,9.42 v79.3,8.18 | v84.1,8.53 81.43,8.53 80.54,9.42
VBAT  (via drill 0.35)
  Top 0.152: v68.99,10.85 70.05,9.78 R18.1 | v67.92,12.62 67.03,12.62 IC2.3 | 56.54,11.73 52.45,11.73 R19.2 | 56.54,11.73 57.61,12.8 IC5.5 57.78,12.98 v57.78,14.22 | 56.54,11.73 56.54,10.13 57.61,9.07 57.61,7.82 C7.1 | 36.98,3.73 36.98,8 R12.2 36.98,8.18 38.76,9.96 42.49,9.96 44.09,11.56 46.41,11.56 C9.1 46.58,11.73 47.3,12.45 v47.3,12.8 | 36.98,3.73 35.74,2.49 J5.1 | 36.98,3.73 39.83,0.89 54.76,0.89 55.12,1.25 58.5,1.25 L2.P$1
  Bottom 0.152: v68.99,10.85 68.99,11.56 v67.92,12.62 67.21,12.62 65.25,14.58 58.14,14.58 v57.78,14.22 48.72,14.22 v47.3,12.8

### Text on the board
Top: piezo-rev-3-10
bPlace: PIEZO | MIXER | PHONE | HEADSET